# Altium project PCB_Project.PrjPcb
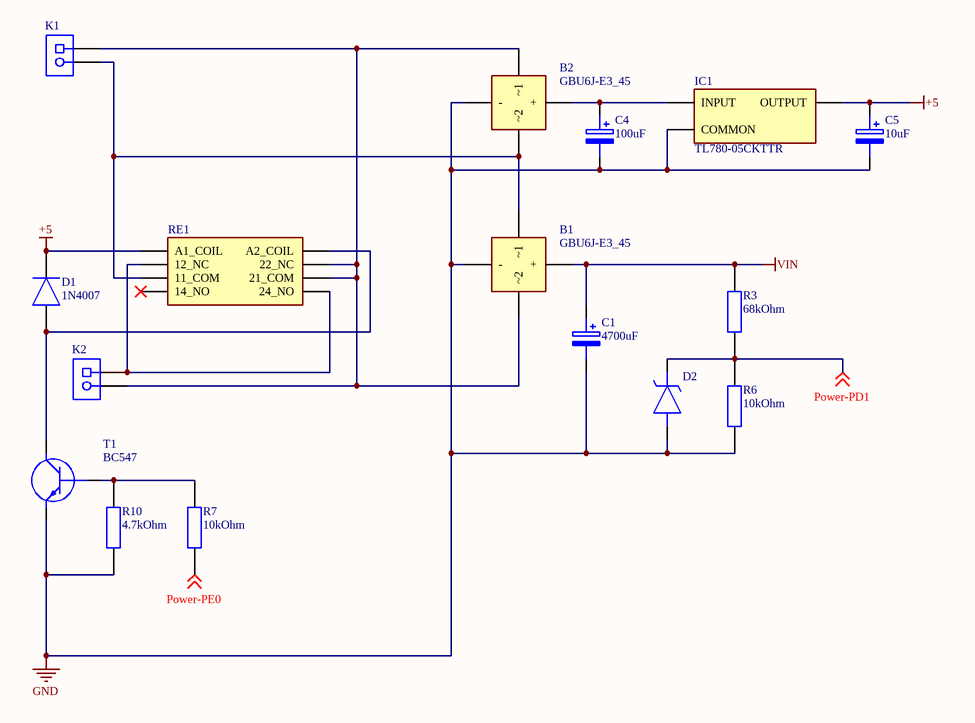
[diagram p0: Power.SchDoc]
5 sheets, 72 parts. Net scope: global (net labels, ports and power ports of the same name join across sheets).
Board file: PCB1.PcbDoc
Sheets:
  Power.SchDoc
  Heating.SchDoc
  Amplification.SchDoc
  Processor.SchDoc
  Display.SchDoc

## Sheet Power.SchDoc
size A4; SheetNumber: 1; SheetTotal: 5

### Parts
B1  GBU6J-E3_45  [GBU6JE345]
B2  GBU6J-E3_45  [GBU6JE345]
C1  4700uF  [4700uF capacitor]
C4  100uF  [100uF capacitor]
C5  10uF  [10uF capacitor]
D1  1N4007  [0.77mm lead diode]
D2  1N5231B  [0.5mm lead diode]  (value not drawn)
IC1  TL780-05CKTTR  [TL78005CKTTR]
K1  1729128  [2-pin terminal block]  (value not drawn)
K2  1729128  [2-pin terminal block]  (value not drawn)
R3  68kOhm  [resistor]
R6  10kOhm  [resistor]
R7  10kOhm  [resistor]
R10  4.7kOhm  [resistor]
RE1  RT424005  [RT42]  (value not drawn)
T1  BC547  [BC547CBU]

### Nets
+5: C5.1(+) D1.1(K) IC1.3(OUTPUT) RE1.1(A1_COIL)
GND: B1.4(-) B2.4(-) C1.2(-) C4.2(-) C5.2(-) D2.2(A) IC1.2(COMMON) R6.1 R10.1 T1.3(E)
VIN: B1.1(+) C1.1(+) R3.2
Power-PD1: D2.1(K) R3.1 R6.2 ; off-sheet Power-PD1
Power-PE0: R7.1 ; off-sheet Power-PE0
NetB1_2: B1.2(~1) B2.3(~2) K1.2 RE1.3(11_COM)
NetB1_3: B1.3(~2) B2.2(~1) K1.1 K2.2 RE1.6(21_COM) RE1.7(22_NC)
NetB2_1: B2.1(+) C4.1(+) IC1.1(INPUT)
NetD1_2: D1.2(A) RE1.8(A2_COIL) T1.1(C)
NetK2_1: K2.1 RE1.2(12_NC) RE1.5(24_NO)
NetR7_2: R7.2 R10.2 T1.2(B)

Not connected (* = marked no-connect by the designer): RE1 4(14_NO)*

### Library data of the parts
B1 B2 = GBU6J-E3_45: Bridge Rectifier; Manufacturer_Name: Vishay; Manufacturer_Part_Number: GBU6J-E3/45; Datasheet Link: http://www.vishay.com/docs/88615/gbu6a.pdf; Height: 18.8mm
C1 = 4700uF capacitor: Capacitor Polarised; Manufacturer_Name: Nichicon; Manufacturer_Part_Number: UVR1H472MRD; Datasheet Link: https://www.mouser.co.uk/datasheet/2/293/e-vr-6088.pdf; Height: 42mm
C4 = 100uF capacitor: Capacitor Polarised; Manufacturer_Name: Kemet; Manufacturer_Part_Number: ESK107M050AG3EA; Height: 12.5mm
C5 = 10uF capacitor: Capacitor Polarised; Manufacturer_Name: Panasonic; Manufacturer_Part_Number: ECA-1HM100B; Datasheet Link: https://componentsearchengine.com//ECA-1HM100B.pdf; Height: 12mm; Mouser2 Part Number: 667-ECA-1HM100B; Mouser2 Price/Stock: https://www.mouser.com/Search/Refine.aspx?Keyword=667-ECA-1HM100B
D1 = 1N4007: Diode; Manufacturer_Name: Diotec; Datasheet Link: https://diotec.com/tl_files/diotec/files/pdf/datasheets/1n4001.pdf; Manufacturer_Part_Number: 1N4007; Mouser Part Number: 637-1N4007; Mouser Price/Stock: https://www.mouser.co.uk/ProductDetail/Diotec-Semiconductor/1N4007?qs=OlC7AqGiEDmK9mU1uTiCkg%3D%3D; Arrow Part Number: 1N4007; Arrow Price/Stock: https://www.arrow.com/en/products/1n4007/diotec-semiconductor-ag?region=europe
D2 = 1N5231B: Zener Diode; Manufacturer_Name: ON Semiconductor; Manufacturer_Part_Number: 1N5231B
IC1 = TL780-05CKTTR: DC Converter; Manufacturer_Name: Texas Instruments; Datasheet Link: http://www.ti.com/general/docs/suppproductinfo.tsp?distId=26&gotoUrl=http%3A%2F%2Fwww.ti.com%2Flit%2Fgpn%2Ftl780; Height: 5.08mm; Manufacturer_Part_Number: TL780-05CKTTR
K1 K2 = MKDSN 1,5/ 2-5,08: PCB Terminal Block, 13.5 A, 400 V, 2-Pin THD, RoHS, Bulk; Manufacturer: Phoenix Contact; Package Version: 03/2015; No. of Rows: 1; Pitch: 5.08mm; No. of Positions: 2; Voltage Rating: 400V; Current Rating: 13500mA; Manufacturer URL: http://www.phoenixcontact.com/; Datasheet URL: https://datasheet.ciiva.com/16046/1729128-16046181.pdf; RoHS: TRUE; Package URL: https://www.phoenixcontact.com/online/portal/pi/pxc/product_detail_page/!ut/p/b1/3VdJjqNKFDxLH8AFycySyWY2ozFsEPOMMQaDOX1XedGL_1Vdm5YXJleknhSKeBkvI6EA8ncAo3AYoDhBQGco6KN7VURTdemj9us_IEKEZo_YHiPAEWEFmDGOHMORkqKYCORBZxgL7ZoaZYcbFFUZ3fqxSY6GOuxydWUuHqz1ynmMFygu583Bob0Ewr6Sd_l-5m-kAueHiB0jpRwZwe58wwtkpxtMYd_LmGcDRU02dRNEyWt6Y2ti5pSyJ_reIkzIulrqApdnbT11V5jnCKbYNCvhEM1MCpPByat_X379-iThf08CI5GfOPqfBeS3BRoBOdD55AKVv0iLwCMq-2BrzXWSGRH7pUGD9uwXQjiph3xL0DKQwdGa0JImiIOmBNOestqgwTHSSs2oOep-78apyXQBvNi8ZLaFjvjWvcaUEBu0MC6Wbe-d6mB0FAebo2lUWinqYaZs5DAYzV0RP9yitUjnGJ0iI9xhZkT42OCQNUJJhkgWINNQLP2JFP6OpMg3JCVg70jqHT0lvKOnhHf0lPuOnnLf0VPuWx6_dxwUIvwk5WMkT0kLL1mh61l2yZVSzG3pYV_bqo-mj6uMKwKwdnnW8Jh5RTOJzMOA5c-eJDaZQw4mTMPH02PvS_ZAqNVjVTo2WyYLkwH_KU1mmmG5kjRhDqPXLwwVHvVOjCM60-fpXvTDfMGW1PVFVS1r4e4yVDk4ZdNbkUHvqPqQSeian4UD39fNKmachqdJ1NJbyk8rXT9mXTvPk3oE5meulKGgiruPJek-4I9hTT6G8ZLOyRSm2RRVbThERQad5OS28hdt4YW4vG0stgYYzsWsK4_7y6DZMjJSCqri1kyiZR5vD7pwIrNR7QwPHTcLTI5qT7eRlpHrdGiupYlqQDJ7zy_CND8fWWBoLRXxk1RVcXiBQwbTD4Xi7KL-FuO94t9xaqweXzH; PartNumber: 1729128; Package Description: 2-Pin Through Hole Device, Body 8.1 x 10.16 mm, Pitch 5.08 mm; Datasheet Version: 12/2013; Mounting Technology: ThroughHole; Orientation: Horizontal; Package Reference: 1729128-2; Packing: Bulk
R3 = 68kOhm resistor: Resistor; Manufacturer_Name: YAGEO (PHYCOMP); Manufacturer_Part_Number: CFR-25JR-52-68K; Datasheet Link: https://componentsearchengine.com/Datasheets/1/CFR-25JR-52-68K.pdf
R6 = 10kOhm resistor: Resistor; Manufacturer_Name: YAGEO (PHYCOMP); Manufacturer_Part_Number: CFR-25JT-52-10K
R7 = 10kOhm: Resistor; Manufacturer_Name: YAGEO (PHYCOMP); Manufacturer_Part_Number: CFR-25JT-52-10K
R10 = 4.7kOhm: Resistor; Manufacturer_Name: YAGEO (PHYCOMP); Manufacturer_Part_Number: CFR-25JT-52-4K7; Datasheet Link: https://componentsearchengine.com//CFR-25JT-52-4K7.pdf; Mouser2 Part Number: 603-CFR-25JT-52-4K7; Mouser2 Price/Stock: https://www.mouser.com/Search/Refine.aspx?Keyword=603-CFR-25JT-52-4K7
RE1 = RT424005: Relay; Manufacturer_Name: TE Connectivity; Datasheet Link: https://componentsearchengine.com//RT424005.pdf; Mouser2 Part Number: 655-RT424005; Mouser2 Price/Stock: https://www.mouser.com/Search/Refine.aspx?Keyword=655-RT424005; Manufacturer_Part_Number: RT424005
T1 = BC547: Transistor BJT NPN; Manufacturer_Name: ON Semiconductor; Datasheet Link: https://www.onsemi.com/pdf/datasheet/bc550-d.pdf; Height: 5.33mm; Manufacturer_Part_Number: BC547CBU

## Sheet Heating.SchDoc
size A4; SheetNumber: 2; SheetTotal: 5
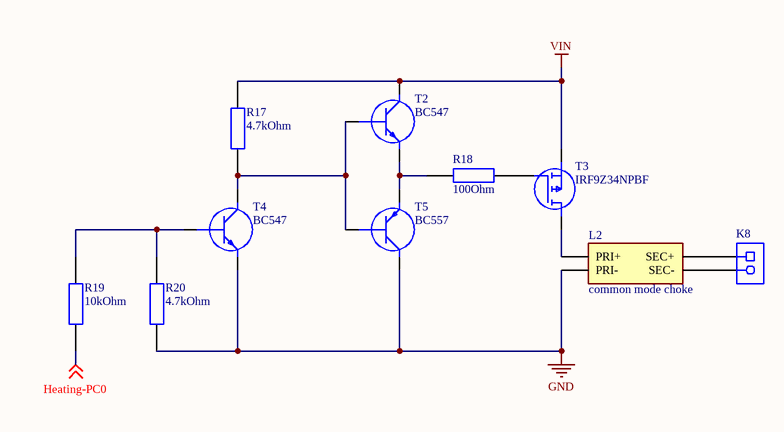
[diagram p1: Heating.SchDoc]

### Parts
K8  1729128  [2-pin terminal block]  (value not drawn)
L2  common mode choke  [common mode choke]
R17  4.7kOhm  [resistor]
R18  100Ohm  [resistor]
R19  10kOhm  [resistor]
R20  4.7kOhm  [resistor]
T2  BC547  [BC547CBU]
T3  IRF9Z34NPBF  [TO254P469X1042X1967-3P]
T4  BC547  [BC547CBU]
T5  BC557  [BC33740TA]

### Nets
GND: L2.4(PRI-) R20.1 T4.3(E) T5.1(C)
VIN: R17.2 T2.1(C) T3.2(S)
Heating-PC0: R19.2 ; off-sheet Heating-PC0
NetK8_1: K8.1 L2.2(SEC+)
NetK8_2: K8.2 L2.3(SEC-)
NetL2_1: L2.1(PRI+) T3.3(D)
NetR17_1: R17.1 T2.2(B) T4.1(C) T5.2(B)
NetR18_1: R18.1 T2.3(E) T5.3(E)
NetR18_2: R18.2 T3.1(G)
NetR19_1: R19.1 R20.2 T4.2(B)

### Library data of the parts
K8 = MKDSN 1,5/ 2-5,08: as K1 on sheet Power; Manufacturer URL: http://www.phoenixcontact.com/; Datasheet URL: https://datasheet.ciiva.com/16046/1729128-16046181.pdf; RoHS: TRUE; Package URL: https://www.phoenixcontact.com/online/portal/pi/pxc/product_detail_page/!ut/p/b1/3VdJjqNKFDxLH8AFycySyWY2ozFsEPOMMQaDOX1XedGL_1Vdm5YXJleknhSKeBkvI6EA8ncAo3AYoDhBQGco6KN7VURTdemj9us_IEKEZo_YHiPAEWEFmDGOHMORkqKYCORBZxgL7ZoaZYcbFFUZ3fqxSY6GOuxydWUuHqz1ynmMFygu583Bob0Ewr6Sd_l-5m-kAueHiB0jpRwZwe58wwtkpxtMYd_LmGcDRU02dRNEyWt6Y2ti5pSyJ_reIkzIulrqApdnbT11V5jnCKbYNCvhEM1MCpPByat_X379-iThf08CI5GfOPqfBeS3BRoBOdD55AKVv0iLwCMq-2BrzXWSGRH7pUGD9uwXQjiph3xL0DKQwdGa0JImiIOmBNOestqgwTHSSs2oOep-78apyXQBvNi8ZLaFjvjWvcaUEBu0MC6Wbe-d6mB0FAebo2lUWinqYaZs5DAYzV0RP9yitUjnGJ0iI9xhZkT42OCQNUJJhkgWINNQLP2JFP6OpMg3JCVg70jqHT0lvKOnhHf0lPuOnnLf0VPuWx6_dxwUIvwk5WMkT0kLL1mh61l2yZVSzG3pYV_bqo-mj6uMKwKwdnnW8Jh5RTOJzMOA5c-eJDaZQw4mTMPH02PvS_ZAqNVjVTo2WyYLkwH_KU1mmmG5kjRhDqPXLwwVHvVOjCM60-fpXvTDfMGW1PVFVS1r4e4yVDk4ZdNbkUHvqPqQSeian4UD39fNKmachqdJ1NJbyk8rXT9mXTvPk3oE5meulKGgiruPJek-4I9hTT6G8ZLOyRSm2RRVbThERQad5OS28hdt4YW4vG0stgYYzsWsK4_7y6DZMjJSCqri1kyiZR5vD7pwIrNR7QwPHTcLTI5qT7eRlpHrdGiupYlqQDJ7zy_CND8fWWBoLRXxk1RVcXiBQwbTD4Xi7KL-FuO94t9xaqweXzH; PartNumber: 1729128; Package Description: 2-Pin Through Hole Device, Body 8.1 x 10.16 mm, Pitch 5.08 mm; Datasheet Version: 12/2013; Mounting Technology: ThroughHole; Orientation: Horizontal; Package Reference: 1729128-2; Packing: Bulk
L2 = common mode choke: Inductor; Manufacturer_Name: Laird Technologies; Manufacturer_Part_Number: CM2545X171B-10; Datasheet Link: https://datasheet.datasheetarchive.com/originals/dk/DKDS-7/122753.pdf; Height: 9.5mm
R17 R20 = 4.7kOhm resistor: Resistor; Manufacturer_Name: YAGEO (PHYCOMP); Manufacturer_Part_Number: CFR-25JT-52-4K7; Datasheet Link: https://componentsearchengine.com//CFR-25JT-52-4K7.pdf; Mouser2 Part Number: 603-CFR-25JT-52-4K7; Mouser2 Price/Stock: https://www.mouser.com/Search/Refine.aspx?Keyword=603-CFR-25JT-52-4K7
R18 = 100Ohm resistor: Resistor; Manufacturer_Name: YAGEO (PHYCOMP); Manufacturer_Part_Number: CFR-25JR-52-100R; Datasheet Link: https://componentsearchengine.com//CFR-25JR-52-100R.pdf; Mouser2 Part Number: 603-CFR-25JR-52100R; Mouser2 Price/Stock: https://www.mouser.com/Search/Refine.aspx?Keyword=603-CFR-25JR-52100R
R19 = 10kOhm resistor: as R6 on sheet Power
T2 T4 = BC547: as T1 on sheet Power; Datasheet Link: https://www.onsemi.com/pdf/datasheet/bc550-d.pdf; Height: 5.33mm; Manufacturer_Part_Number: BC547CBU
T3 = IRF9Z34NPBF: MOSFET (P-Channel); Manufacturer_Name: Infineon; Datasheet Link: https://componentsearchengine.com//IRF9Z34NPBF.pdf; Height: 4.69mm; Mouser2 Part Number: 942-IRF9Z34NPBF; Mouser2 Price/Stock: https://www.mouser.com/Search/Refine.aspx?Keyword=942-IRF9Z34NPBF; Manufacturer_Part_Number: IRF9Z34NPBF
T5 = BC557: Transistor BJT PNP; Manufacturer_Name: ON Semiconductor; Manufacturer_Part_Number: BC557ATA; Datasheet Link: https://componentsearchengine.com//BC557ATA.pdf; Mouser2 Part Number: 512-BC557ATA; Mouser2 Price/Stock: https://www.mouser.com/Search/Refine.aspx?Keyword=512-BC557ATA

## Sheet Amplification.SchDoc
size A4; SheetNumber: 3; SheetTotal: 5
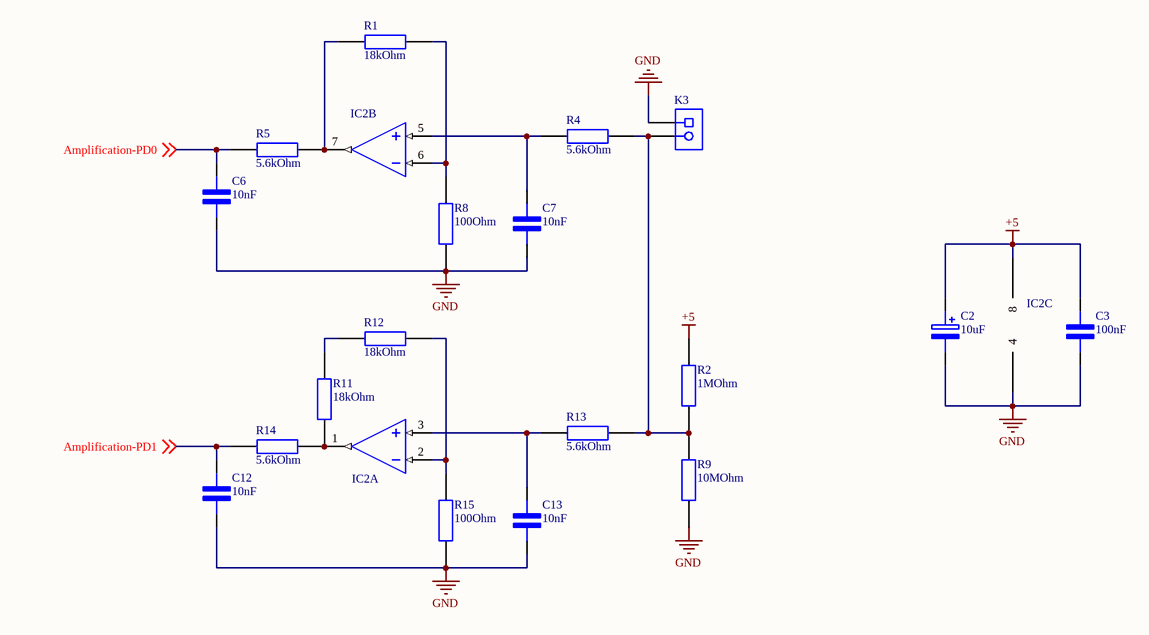
[diagram p2: Amplification.SchDoc]

### Parts
C2  10uF  [10uF capacitor]
C3  100nF  [5mm lead spacing capacitor]
C6  10nF  [5mm lead spacing capacitor]
C7  10nF  [5mm lead spacing capacitor]
C12  10nF  [5mm lead spacing capacitor]
C13  10nF  [5mm lead spacing capacitor]
IC2  MCP6002-E/P  [DIP8E]  (value not drawn)  (parts A,B,C of 3)
K3  1729128  [2-pin terminal block]  (value not drawn)
R1  18kOhm  [resistor]
R2  1MOhm  [resistor]
R4  5.6kOhm  [resistor]
R5  5.6kOhm  [resistor]
R8  100Ohm  [resistor]
R9  10MOhm  [resistor]
R11  18kOhm  [resistor]
R12  18kOhm  [resistor]
R13  5.6kOhm  [resistor]
R14  5.6kOhm  [resistor]
R15  100Ohm  [resistor]

### Nets
+5: C2.1(+) C3.2(-) IC2.8 R2.2
GND: C2.2(-) C3.1(+) C6.1(+) C7.1(+) C12.1(+) C13.1(+) IC2.4 K3.1 R8.1 R9.1 R15.1
Amplification-PD0: C6.2(-) R5.1 ; off-sheet Amplification-PD0
Amplification-PD1: C12.2(-) R14.1 ; off-sheet Amplification-PD1
NetC7_2: C7.2(-) IC2.5(VINB+) R4.2
NetC13_2: C13.2(-) IC2.3(VINA+) R13.1
NetIC2_1: IC2.1(VOUTA) R11.1 R14.2
NetIC2_2: IC2.2(VINA-) R12.2 R15.2
NetIC2_6: IC2.6(VINB-) R1.2 R8.2
NetIC2_7: IC2.7(VOUTB) R1.1 R5.2
NetK3_2: K3.2 R2.1 R4.1 R9.2 R13.2
NetR11_2: R11.2 R12.1

### Library data of the parts
C2 = 10uF capacitor: as C5 on sheet Power; Datasheet Link: https://componentsearchengine.com//ECA-1HM100B.pdf; Height: 12mm; Mouser2 Part Number: 667-ECA-1HM100B; Mouser2 Price/Stock: https://www.mouser.com/Search/Refine.aspx?Keyword=667-ECA-1HM100B
C3 = 100nF capacitor: Capacitor; Manufacturer_Name: Nichicon; Manufacturer_Part_Number: UVR1H472MRD; Datasheet Link: https://www.mouser.co.uk/datasheet/2/293/e-vr-6088.pdf; Height: 42mm
C6 C7 C12 C13 = 10nF capacitor: Capacitor; Manufacturer_Name: Nichicon; Manufacturer_Part_Number: UVR1H472MRD; Datasheet Link: https://www.mouser.co.uk/datasheet/2/293/e-vr-6088.pdf; Height: 42mm
IC2 = MCP6002-E/P: Dual Opamp; Slew Rate: 0.6V/µs; Supply Current: 100uA; Power Supply Rejection Ratio (PSRR): 86dB; Input Offset Voltage (Vos): 4.5mV; Input Bias Current: 1pA; Amplifier Type: GENERAL PURPOSE; Unity Gain Bandwidth Product: 1MHz; Number of Circuits: 2; Output Current: 23mA; Operating Supply Voltage: 5.5V; Min Supply Voltage: 1.8V; Common Mode Rejection Ratio: 60dB; Voltage Gain: 112dB; Max Supply Voltage: 6V; Package Quantity: 60; REACH SVHC: No SVHC; Min Operating Temperature: -40°C; Max Operating Temperature: 125°C; Mount: Through Hole; Nominal Supply Current: 100uA; Height: 3.3mm; Length: 9.27mm; Slew Rate-Nom: 0.6V/µs; Packaging: Rail/Tube; Output Current per Channel: 23mA; Number of Amplifiers: 2; RoHS Compliant: Yes; Radiation Hardening: No; Bandwidth: 1MHz; Lead Free: Lead Free; Width: 6.35mm; Number of Channels: 2; Gain Bandwidth Product: 1MHz; Technology: CMOS; Operating Supply Current: 100uA; Number of Elements: 2; Number of Pins: 8; Input Offset Voltage-Max: 4.5mV; Case/Package: PDIP
K3 = MKDSN 1,5/ 2-5,08: as K1 on sheet Power; Manufacturer URL: http://www.phoenixcontact.com/; Datasheet URL: https://datasheet.ciiva.com/16046/1729128-16046181.pdf; RoHS: TRUE; Package URL: https://www.phoenixcontact.com/online/portal/pi/pxc/product_detail_page/!ut/p/b1/3VdJjqNKFDxLH8AFycySyWY2ozFsEPOMMQaDOX1XedGL_1Vdm5YXJleknhSKeBkvI6EA8ncAo3AYoDhBQGco6KN7VURTdemj9us_IEKEZo_YHiPAEWEFmDGOHMORkqKYCORBZxgL7ZoaZYcbFFUZ3fqxSY6GOuxydWUuHqz1ynmMFygu583Bob0Ewr6Sd_l-5m-kAueHiB0jpRwZwe58wwtkpxtMYd_LmGcDRU02dRNEyWt6Y2ti5pSyJ_reIkzIulrqApdnbT11V5jnCKbYNCvhEM1MCpPByat_X379-iThf08CI5GfOPqfBeS3BRoBOdD55AKVv0iLwCMq-2BrzXWSGRH7pUGD9uwXQjiph3xL0DKQwdGa0JImiIOmBNOestqgwTHSSs2oOep-78apyXQBvNi8ZLaFjvjWvcaUEBu0MC6Wbe-d6mB0FAebo2lUWinqYaZs5DAYzV0RP9yitUjnGJ0iI9xhZkT42OCQNUJJhkgWINNQLP2JFP6OpMg3JCVg70jqHT0lvKOnhHf0lPuOnnLf0VPuWx6_dxwUIvwk5WMkT0kLL1mh61l2yZVSzG3pYV_bqo-mj6uMKwKwdnnW8Jh5RTOJzMOA5c-eJDaZQw4mTMPH02PvS_ZAqNVjVTo2WyYLkwH_KU1mmmG5kjRhDqPXLwwVHvVOjCM60-fpXvTDfMGW1PVFVS1r4e4yVDk4ZdNbkUHvqPqQSeian4UD39fNKmachqdJ1NJbyk8rXT9mXTvPk3oE5meulKGgiruPJek-4I9hTT6G8ZLOyRSm2RRVbThERQad5OS28hdt4YW4vG0stgYYzsWsK4_7y6DZMjJSCqri1kyiZR5vD7pwIrNR7QwPHTcLTI5qT7eRlpHrdGiupYlqQDJ7zy_CND8fWWBoLRXxk1RVcXiBQwbTD4Xi7KL-FuO94t9xaqweXzH; PartNumber: 1729128; Package Description: 2-Pin Through Hole Device, Body 8.1 x 10.16 mm, Pitch 5.08 mm; Datasheet Version: 12/2013; Mounting Technology: ThroughHole; Orientation: Horizontal; Package Reference: 1729128-2; Packing: Bulk
R1 R11 R12 = 18kOhm resistor: Resistor; Manufacturer_Name: YAGEO (PHYCOMP); Manufacturer_Part_Number: CFR-25JT-52-10K
R2 = 1MOhm resistor: Resistor; Manufacturer_Name: Ohmite; Manufacturer_Part_Number: OK1055E-R52
R4 R5 R13 R14 = 5.6kOhm resistor: Resistor; Manufacturer_Name: YAGEO (PHYCOMP); Manufacturer_Part_Number: CFR-25JB-52-5K6; Datasheet Link: https://componentsearchengine.com//CFR-25JB-52-5K6.pdf; Mouser2 Part Number: 603-CFR-25JB-52-5K6; Mouser2 Price/Stock: https://www.mouser.com/Search/Refine.aspx?Keyword=603-CFR-25JB-52-5K6
R8 R15 = 100Ohm resistor: as R18 on sheet Heating; Datasheet Link: https://componentsearchengine.com//CFR-25JR-52-100R.pdf; Mouser2 Part Number: 603-CFR-25JR-52100R; Mouser2 Price/Stock: https://www.mouser.com/Search/Refine.aspx?Keyword=603-CFR-25JR-52100R
R9 = 10MOhm resistor: Resistor; Manufacturer_Name: YAGEO (PHYCOMP); Manufacturer_Part_Number: CFR-25JT-52-10M; Datasheet Link: https://datasheet.datasheetarchive.com/originals/distributors/Datasheets_SAMA/cf5c7c7b14e59499e9125003e6ee5ce2.pdf

## Sheet Processor.SchDoc
size A4; SheetNumber: 4; SheetTotal: 5
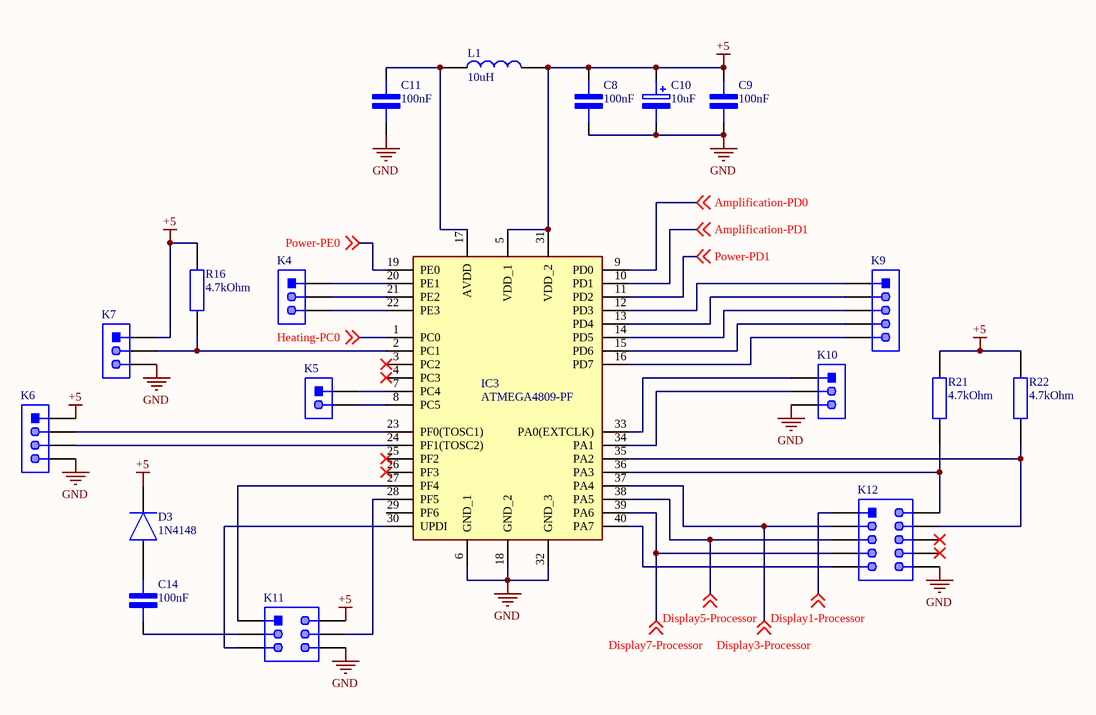
[diagram p3: Processor.SchDoc]

### Parts
C8  100nF  [5mm lead spacing capacitor]
C9  100nF  [5mm lead spacing capacitor]
C10  10uF  [10uF capacitor]
C11  100nF  [5mm lead spacing capacitor]
C14  100nF  [5mm lead spacing capacitor]
D3  1N4148  [0.5mm lead diode]
IC3  ATMEGA4809-PF  [DIP40E]
K4  61300311121  [3-pin header]  (value not drawn)
K5  61300311121  [2-pin header]  (value not drawn)
K6  61300411121  [4-pin header]  (value not drawn)
K7  61300311121  [3-pin header]  (value not drawn)
K9  61300411121  [5-pin header]  (value not drawn)
K10  61300311121  [3-pin header]  (value not drawn)
K11  61301621121  [2-row 6-pin header]  (value not drawn)
K12  61301621121  [10-way boxheader]  (value not drawn)
L1  10uH  [10uH choke coil]
R16  4.7kOhm  [resistor]
R21  4.7kOhm  [resistor]
R22  4.7kOhm  [resistor]

### Nets
+5: C8.2(-) C9.2(-) C10.1(+) D3.1(K) IC3.5(VDD_1) IC3.31(VDD_2) K6.1 K7.1 K11.2 K12.1 L1.2 R16.2 R21.2 R22.2 ; off-sheet Display1-Processor  [also labelled Display1-Processor]
GND: C8.1(+) C9.1(+) C10.2(-) C11.1(+) IC3.6(GND_1) IC3.18(GND_2) IC3.32(GND_3) K6.4 K7.3 K10.3 K11.6 K12.10
Amplification-PD0: IC3.9(PD0) ; off-sheet Amplification-PD0
Amplification-PD1: IC3.10(PD1) ; off-sheet Amplification-PD1
Display3-Processor: IC3.37(PA4) K12.3 ; off-sheet Display3-Processor
Display5-Processor: IC3.38(PA5) K12.5 ; off-sheet Display5-Processor
Display7-Processor: IC3.39(PA6) K12.7 ; off-sheet Display7-Processor
Heating-PC0: IC3.1(PC0) ; off-sheet Heating-PC0
Power-PD1: IC3.11(PD2) ; off-sheet Power-PD1
Power-PE0: IC3.19(PE0) ; off-sheet Power-PE0
NetC11_2: C11.2(-) IC3.17(AVDD) L1.1
NetC14_1: C14.1(+) K11.3
NetC14_2: C14.2(-) D3.2(A)
NetIC3_2: IC3.2(PC1) K7.2 R16.1
NetIC3_7: IC3.7(PC4) K5.1
NetIC3_8: IC3.8(PC5) K5.2
NetIC3_12: IC3.12(PD3) K9.1
NetIC3_13: IC3.13(PD4) K9.2
NetIC3_14: IC3.14(PD5) K9.3
NetIC3_15: IC3.15(PD6) K9.4
NetIC3_16: IC3.16(PD7) K9.5
NetIC3_20: IC3.20(PE1) K4.1
NetIC3_21: IC3.21(PE2) K4.2
NetIC3_22: IC3.22(PE3) K4.3
NetIC3_23: IC3.23(PF0(TOSC1)) K6.2
NetIC3_24: IC3.24(PF1(TOSC2)) K6.3
NetIC3_27: IC3.27(PF4) K11.1
NetIC3_28: IC3.28(PF5) K11.4
NetIC3_30: IC3.30(UPDI) K11.5
NetIC3_33: IC3.33(PA0(EXTCLK)) K10.1
NetIC3_34: IC3.34(PA1) K10.2
NetIC3_35: IC3.35(PA2) K12.4 R22.1
NetIC3_36: IC3.36(PA3) K12.2 R21.1
NetIC3_40: IC3.40(PA7) K12.9

Not connected (* = marked no-connect by the designer): IC3 3(PC2)* 4(PC3)* 25(PF2)* 26(PF3)* 29(PF6); K12 6* 8*

### Library data of the parts
C8 C14 = 100nF: Capacitor; Manufacturer_Name: Nichicon; Manufacturer_Part_Number: UVR1H472MRD; Datasheet Link: https://www.mouser.co.uk/datasheet/2/293/e-vr-6088.pdf; Height: 42mm
C9 C11 = 100nF capacitor: as C3 on sheet Amplification; Datasheet Link: https://www.mouser.co.uk/datasheet/2/293/e-vr-6088.pdf; Height: 42mm
C10 = 10uF capacitor: as C5 on sheet Power; Datasheet Link: https://componentsearchengine.com//ECA-1HM100B.pdf; Height: 12mm; Mouser2 Part Number: 667-ECA-1HM100B; Mouser2 Price/Stock: https://www.mouser.com/Search/Refine.aspx?Keyword=667-ECA-1HM100B
D3 = 1N4148: Diode; Manufacturer_Name: Nexperia; Datasheet Link: https://datasheet.datasheetarchive.com/originals/distributors/Datasheets-112/DSAP0040891.pdf; Manufacturer_Part_Number: 1N4148
IC3 = ATMEGA4809-PF: Integrated Circuit; Manufacturer_Name: Microchip; Datasheet Link: https://componentsearchengine.com//ATMEGA4809-PF.pdf; Height: 6.35mm; Mouser2 Part Number: 556-ATMEGA4809-PF; Mouser2 Price/Stock: https://www.mouser.com/Search/Refine.aspx?Keyword=556-ATMEGA4809-PF; Manufacturer_Part_Number: ATMEGA4809-PF
K4 K7 K10 = 3-pin header: THT Vertical Pin Header WR-PHD, Pitch 2.54 mm, Single Row, 3 pins; Manufacturer: Wurth Elektronik; Withstanding Voltage: 500VAC; Working Voltage: 250VAC; Rated Current: 3A; Pitch: 2.54mm; Pin Number: 3; Gender: Male; Contact Resistance: 20mOhm; Package Reference: 61300311121; Manufacturer URL: http://www.we-online.de; Datasheet URL: https://katalog.we-online.de/em/datasheet/6130xx11121.pdf; Operating Temperature: -40to105degC; Part Number: 61300311121; Orientation: Vertical; Packaging: Bag; Row Number: Single; Mounting Technology: THT; Publisher: WurthElektronik
K5 = 2-pin header: THT Vertical Pin Header WR-PHD, Pitch 2.54 mm, Single Row, 3 pins; Manufacturer: Wurth Elektronik; Withstanding Voltage: 500VAC; Working Voltage: 250VAC; Rated Current: 3A; Pitch: 2.54mm; Pin Number: 3; Gender: Male; Contact Resistance: 20mOhm; Package Reference: 61300311121; Manufacturer URL: http://www.we-online.de; Datasheet URL: https://katalog.we-online.de/em/datasheet/6130xx11121.pdf; Operating Temperature: -40to105degC; Part Number: 61300311121; Orientation: Vertical; Packaging: Bag; Row Number: Single; Mounting Technology: THT; Publisher: WurthElektronik
K6 = 4-pin header: THT Vertical Pin Header WR-PHD, Pitch 2.54 mm, Single Row, 4 pins; Manufacturer: Wurth Elektronik; Withstanding Voltage: 500VAC; Rated Current: 3A; Working Voltage: 250VAC; Pin Number: 4; Gender: Male; Contact Resistance: 20mOhm; Pitch: 2.54mm; Manufacturer URL: http://www.we-online.de; Operating Temperature: -40to105degC; Packaging: Bag; Mounting Technology: THT; Package Reference: 61300411121; Datasheet URL: https://katalog.we-online.de/em/datasheet/6130xx11121.pdf; Publisher: WurthElektronik; Part Number: 61300411121; Row Number: Single; Orientation: Vertical
K9 = 5-pin header: THT Vertical Pin Header WR-PHD, Pitch 2.54 mm, Single Row, 4 pins; Manufacturer: Wurth Elektronik; Withstanding Voltage: 500VAC; Rated Current: 3A; Working Voltage: 250VAC; Pin Number: 4; Gender: Male; Contact Resistance: 20mOhm; Pitch: 2.54mm; Manufacturer URL: http://www.we-online.de; Operating Temperature: -40to105degC; Packaging: Bag; Mounting Technology: THT; Package Reference: 61300411121; Datasheet URL: https://katalog.we-online.de/em/datasheet/6130xx11121.pdf; Publisher: WurthElektronik; Part Number: 61300411121; Row Number: Single; Orientation: Vertical
K11 = 6-pin header: THT Vertical Pin Header WR-PHD, Pitch 2.54 mm, Dual Row, 16 pins; Manufacturer: Wurth Elektronik; Gender: Male; Rated Current: 3A; Pitch: 2.54mm; Withstanding Voltage: 500VAC; Contact Resistance: 20mOhm; Working Voltage: 250VAC; Pin Number: 16; Mounting Technology: THT; Orientation: Vertical; Manufacturer URL: http://www.we-online.de; Row Number: Dual; Part Number: 61301621121; Datasheet URL: https://katalog.we-online.de/em/datasheet/6130xx21121.pdf; Packaging: Bag; Operating Temperature: -40to105degC; Publisher: WurthElektronik; Package Reference: 61301621121
K12 = 10-pole box header: THT Vertical Pin Header WR-PHD, Pitch 2.54 mm, Dual Row, 16 pins; Manufacturer: Wurth Elektronik; Gender: Male; Rated Current: 3A; Pitch: 2.54mm; Withstanding Voltage: 500VAC; Contact Resistance: 20mOhm; Working Voltage: 250VAC; Pin Number: 16; Mounting Technology: THT; Orientation: Vertical; Manufacturer URL: http://www.we-online.de; Row Number: Dual; Part Number: 61301621121; Datasheet URL: https://katalog.we-online.de/em/datasheet/6130xx21121.pdf; Packaging: Bag; Operating Temperature: -40to105degC; Publisher: WurthElektronik; Package Reference: 61301621121
L1 = 10uH choke coil: Inductor; Manufacturer_Name: Bourns; Manufacturer_Part_Number: 78F100J-RC; Datasheet Link: https://componentsearchengine.com//78F100J-RC.pdf; Mouser2 Part Number: 542-78F100-RC; Mouser2 Price/Stock: https://www.mouser.com/Search/Refine.aspx?Keyword=542-78F100-RC
R16 R21 R22 = 4.7kOhm: as R10 on sheet Power; Datasheet Link: https://componentsearchengine.com//CFR-25JT-52-4K7.pdf; Mouser2 Part Number: 603-CFR-25JT-52-4K7; Mouser2 Price/Stock: https://www.mouser.com/Search/Refine.aspx?Keyword=603-CFR-25JT-52-4K7

## Sheet Display.SchDoc
size A4; SheetNumber: 5; SheetTotal: 5
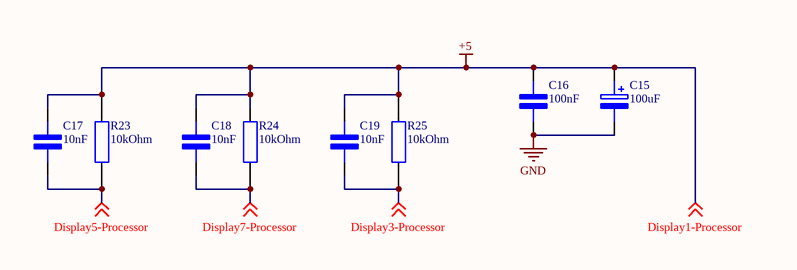
[diagram p4: Display.SchDoc]

### Parts
C15  100uF  [100uF capacitor]
C16  100nF  [5mm lead spacing capacitor]
C17  10nF  [5mm lead spacing capacitor]
C18  10nF  [5mm lead spacing capacitor]
C19  10nF  [5mm lead spacing capacitor]
R23  10kOhm  [resistor]
R24  10kOhm  [resistor]
R25  10kOhm  [resistor]

### Nets
+5: C15.1(+) C16.2(-) C17.2(-) C18.2(-) C19.2(-) R23.2 R24.2 R25.2 ; off-sheet Display1-Processor  [also labelled Display1-Processor]
GND: C15.2(-) C16.1(+)
Display3-Processor: C19.1(+) R25.1 ; off-sheet Display3-Processor
Display5-Processor: C17.1(+) R23.1 ; off-sheet Display5-Processor
Display7-Processor: C18.1(+) R24.1 ; off-sheet Display7-Processor

### Library data of the parts
C15 = 100uF: Capacitor Polarised; Manufacturer_Name: Kemet; Manufacturer_Part_Number: ESK107M050AG3EA; Height: 12.5mm
C16 = 100nF: as C8 on sheet Processor; Datasheet Link: https://www.mouser.co.uk/datasheet/2/293/e-vr-6088.pdf; Height: 42mm
C17-C19 = 10nF: Capacitor; Manufacturer_Name: Nichicon; Manufacturer_Part_Number: UVR1H472MRD; Datasheet Link: https://www.mouser.co.uk/datasheet/2/293/e-vr-6088.pdf; Height: 42mm
R23-R25 = 10kOhm: as R7 on sheet Power

## Nets that join several sheets
+5: Power (C5.1 D1.1 IC1.3 RE1.1), Amplification (C2.1 C3.2 IC2.8 R2.2), Processor (14 pins), Display (8 pins)
GND: Power (10 pins), Heating (L2.4 R20.1 T4.3 T5.1), Amplification (11 pins), Processor (12 pins), Display (C15.2 C16.1)
VIN: Power (B1.1 C1.1 R3.2), Heating (R17.2 T2.1 T3.2)
Amplification-PD0: Amplification (C6.2 R5.1), Processor (IC3.9)
Amplification-PD1: Amplification (C12.2 R14.1), Processor (IC3.10)
Display3-Processor: Processor (IC3.37 K12.3), Display (C19.1 R25.1)
Display5-Processor: Processor (IC3.38 K12.5), Display (C17.1 R23.1)
Display7-Processor: Processor (IC3.39 K12.7), Display (C18.1 R24.1)
Heating-PC0: Heating (R19.2), Processor (IC3.1)
Power-PD1: Power (D2.1 R3.1 R6.2), Processor (IC3.11)
Power-PE0: Power (R7.1), Processor (IC3.19)